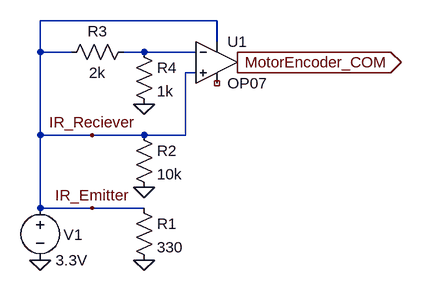
[diagram p0: schematic IR_Motor_Encoder.asc]
IR_Motor_Encoder.asc, the LTspice schematic file:
Version 4
SHEET 1 880 680
WIRE 384 80 112 80
WIRE 384 112 384 80
WIRE 112 128 112 80
WIRE 160 128 112 128
WIRE 272 128 240 128
WIRE 352 128 272 128
WIRE 352 160 336 160
WIRE 112 256 112 128
WIRE 192 256 112 256
WIRE 272 256 192 256
WIRE 336 256 336 160
WIRE 336 256 272 256
WIRE 112 368 112 256
WIRE 192 368 112 368
WIRE 272 368 192 368
FLAG 272 448 0
FLAG 192 368 IR_Emitter
FLAG 112 448 0
FLAG 272 336 0
FLAG 192 256 IR_Reciever
FLAG 272 208 0
FLAG 416 144 MotorEncoder_COM
IOPIN 416 144 Out
SYMBOL OP07 384 80 R0
SYMATTR InstName U1
SYMBOL res 256 352 R0
SYMATTR InstName R1
SYMATTR Value 330
SYMBOL voltage 112 352 R0
WINDOW 0 36 57 Left 2
SYMATTR InstName V1
SYMATTR Value 3.3V
SYMBOL res 256 240 R0
SYMATTR InstName R2
SYMATTR Value 10k
SYMBOL res 256 112 R90
WINDOW 0 0 56 VBottom 2
WINDOW 3 32 56 VTop 2
SYMATTR InstName R3
SYMATTR Value 2k
SYMBOL res 256 112 R0
SYMATTR InstName R4
SYMATTR Value 1k

The netlist it stands for:
* IR_Motor_Encoder.asc
XU1 IR_Reciever N001 IR_Reciever NC_01 MotorEncoder_COM LT1001  ; OP07, pins In+ In- V+ V- OUT
R1 IR_Reciever 0 330
V1 IR_Reciever 0 3.3V
R2 IR_Reciever 0 10k
R3 N001 IR_Reciever 2k
R4 N001 0 1k
.lib LTC.lib
.backanno
.end